# EasyEDA schematic cheap-boy_(V1.0)_2026-07-27.json
TITLE: Sheet_1; REV: 1.0; Date: 2026-07-13; Sheet: 1/1; Drawn By: rumidom
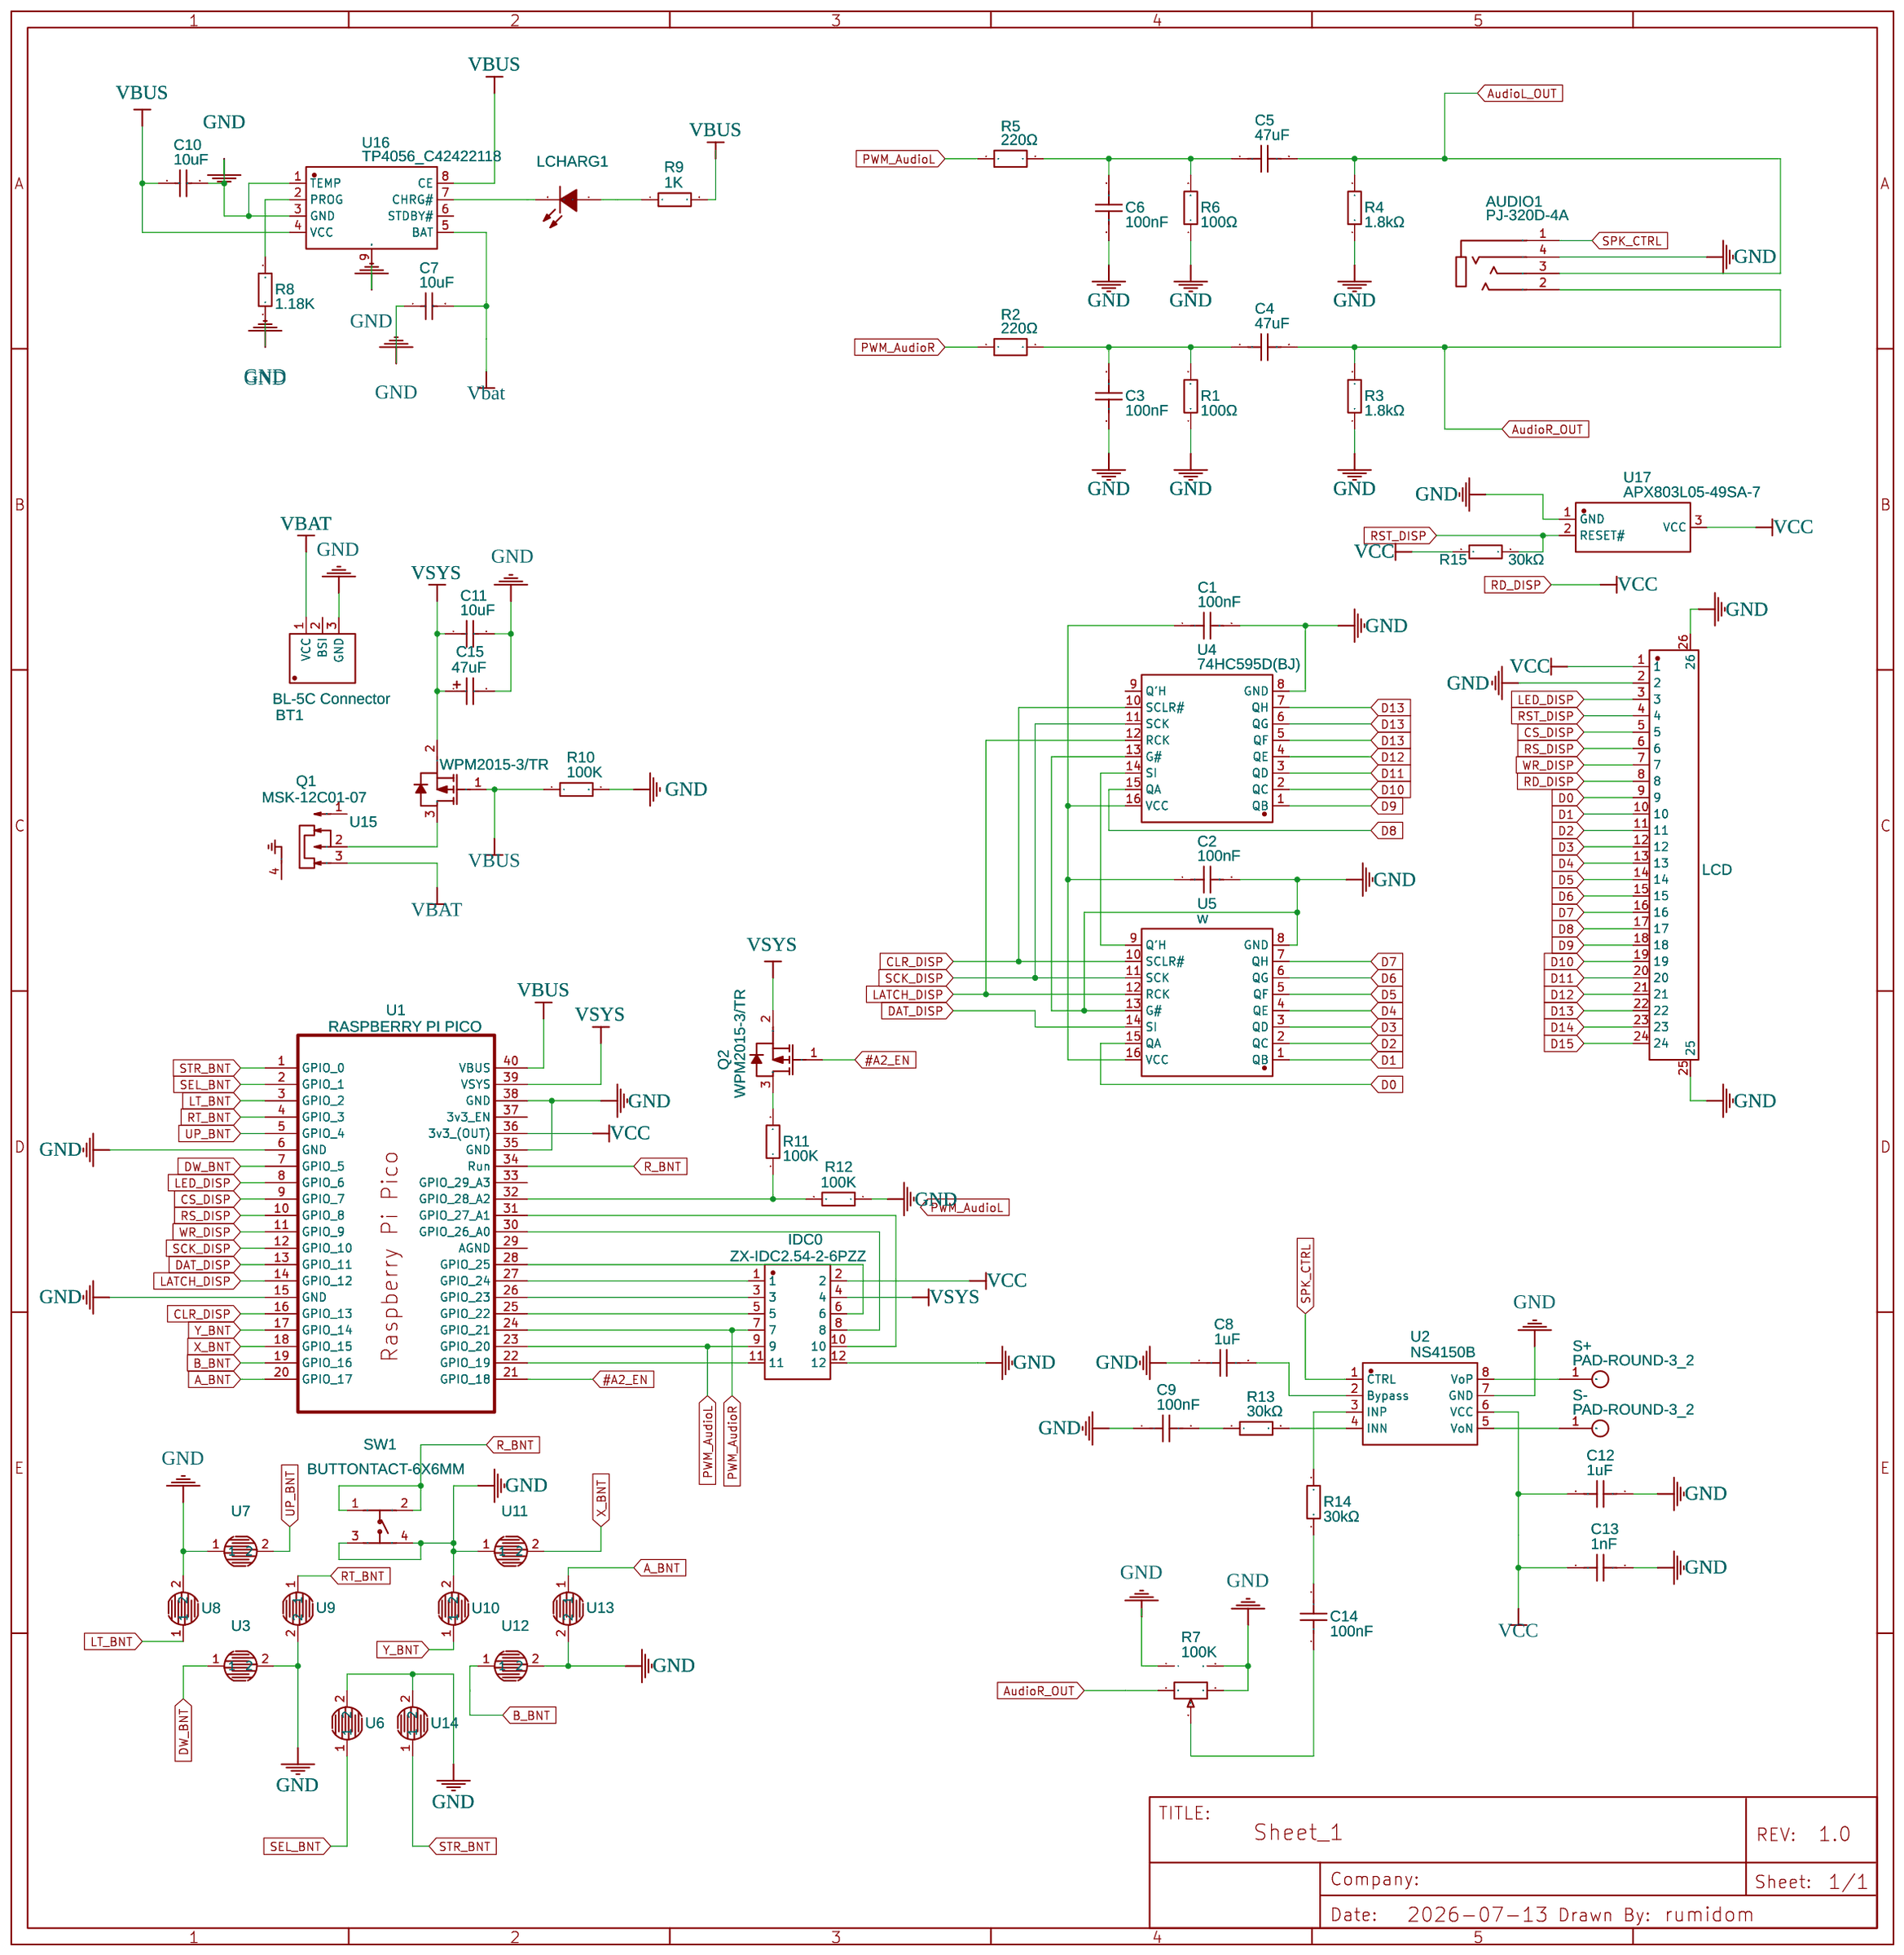
[diagram p0: schematic sheet]

## Parts
AUDIO1  PJ-320D-4A  [AUDIO-SMD_PJ-320D]
BT1  BL-5C Connector  [BL-5C CONNECTOR]
C1  100nF  [C0603]
C2  100nF  [C0603]
C3  100nF  [C0603]
C4  47uF  [C0805]
C5  47uF  [C0805]
C6  100nF  [C0603]
C7  10uF  [C0402]
C8  1uF  [C0603]
C9  100nF  [C0603]
C10  10uF  [C0402]
C11  10uF  [C0402]
C12  1uF  [C0603]
C13  1nF  [C0603]
C14  100nF  [C0603]
C15  47uF  [CAP-SMD_L3.2-W1.6-R-RD]
FPC  LCD  [FPC-SMD_24P-P0.50_FPC-05FB-24PH20]
IDC0  ZX-IDC2.54-2-6PZZ  [IDC-TH_12P-P2.54_ZX-IDC2.54-2-6PZZ]
LCHARG1  TJ-S1608SW6TGLC2R-A5  [LED0603-R-RD]
Q1  WPM2015-3/TR  [SOT-23-3_L2.9-W1.6-P1.90-LS2.8-BR]
Q2  WPM2015-3/TR  [SOT-23-3_L2.9-W1.6-P1.90-LS2.8-BR]
R1  100Ω  [R0603]
R2  220Ω  [R0603]
R3  1.8kΩ  [R0603]
R4  1.8kΩ  [R0603]
R5  220Ω  [R0603]
R6  100Ω  [R0603]
R7  100K  [RES-TH_WH160-1-104]
R8  1.18K  [R0402]
R9  1K  [R0402]
R10  100K  [R0402]
R11  100K  [R0402]
R12  100K  [R0402]
R13  30kΩ  [R0805]
R14  30kΩ  [R0805]
R15  30kΩ  [R0805]
S+  PAD-ROUND-3_2  [PADPAD]
S-  PAD-ROUND-3_2  [PADPAD]
SW1  BUTTONTACT-6X6MM  [SW-SMD_4P-L6.0-W6.0-P4.50-LS9.2]
U1  RASPBERRY PI PICO  [RASPBERRY PI PICO SMD]
U2  NS4150B  [SOIC-8_L4.9-W3.9-P1.27-LS6.0-BL]
U3  XBOX GAMEPAD DPAD BUTTON  [5MM MEMBRANE BUTTON PAD OK]
U4  74HC595D(BJ)  [SOIC-16_L9.9-W3.9-P1.27-LS6.0-BL]
U5  w  [SOIC-16_L9.9-W3.9-P1.27-LS6.0-BL]
U6  XBOX GAMEPAD DPAD BUTTON  [5MM MEMBRANE BUTTON PAD OK]
U7  XBOX GAMEPAD DPAD BUTTON  [5MM MEMBRANE BUTTON PAD OK]
U8  XBOX GAMEPAD DPAD BUTTON  [5MM MEMBRANE BUTTON PAD OK]
U9  XBOX GAMEPAD DPAD BUTTON  [5MM MEMBRANE BUTTON PAD OK]
U10  XBOX GAMEPAD DPAD BUTTON  [5MM MEMBRANE BUTTON PAD OK]
U11  XBOX GAMEPAD DPAD BUTTON  [5MM MEMBRANE BUTTON PAD OK]
U12  XBOX GAMEPAD DPAD BUTTON  [5MM MEMBRANE BUTTON PAD OK]
U13  XBOX GAMEPAD DPAD BUTTON  [5MM MEMBRANE BUTTON PAD OK]
U14  XBOX GAMEPAD DPAD BUTTON  [5MM MEMBRANE BUTTON PAD OK]
U15  MSK-12C01-07  [SW-SMD_MSK12CO2-BDM]
U16  TP4056_C42422118  [ESOP-8_L4.9-W3.9-P1.27-LS6.0-BL-EP-1]
U17  APX803L05-49SA-7  [SOT-23-3_L2.9-W1.3-P1.83-LS2.4-BL]

## Library data of the parts
AUDIO1 = PJ-320D-4A: Contributor: LCSC; Supplier: LCSC; Manufacturer: HRO; Supplier Part: C128988
BT1 = BL-5C Connector: Manufacturer: MAHA; Contributor: alif2030
C1 C2 = VJ0603Y104KXAAT: Supplier: LCSC; Supplier Part: C5342943; Manufacturer: VISHAY(威世); JLCPCB Part Class: Extended Part; Contributor: lcsc
C3 C6 C9 C14 = 0603X7R104K100NT: Supplier: LCSC; Supplier Part: C49326605; Manufacturer: AIDE(爱迪电容); JLCPCB Part Class: Extended Part; Contributor: lcsc
C4 C5 = GRM21BR60J476ME01K: Supplier: LCSC; Supplier Part: C7198905; Manufacturer: muRata(村田); Contributor: lcsc; JLCPCB Part Class: Extended Part
C7 C10 C11 = CL05A106MQ5NUNC: Supplier: LCSC; Manufacturer: SAMSUNG; LCSC Assembly: Yes; Supplier Part: C15525; SMT Type: Basic
C8 C12 = MCASE168SB7105KTNA01: Supplier: LCSC; Supplier Part: C7225350; Manufacturer: TAIYO YUDEN(太诱); JLCPCB Part Class: Extended Part; Contributor: lcsc
C13 = C0603C102J3GACAUTO7411: Contributor: LCSC; Supplier: LCSC; Supplier Part: C599630; Manufacturer: KEMET(基美); JLCPCB Part Class: Extended Part
C15 = CA45B-A-6.3V-47UF-K: Supplier: LCSC; Manufacturer: CEC; Manufacturer Part: CA45B-A-6.3V-47uF-K; Contributor: LCSC; Supplier Part: C141304; LCSC Assembly: Yes; SMT Type: Extend
FPC = FPC-05FB-24PH20 LKK: Contributor: LCSC; Supplier: LCSC; Supplier Part: C2856831; Manufacturer: XUNPU(讯普); Manufacturer Part: FPC-05FB-24PH20; JLCPCB Part Class: Extended Part
IDC0 = ZX-IDC2.54-2-6PZZ: Supplier: LCSC; Supplier Part: C7501192; Manufacturer: Megastar(兆星); Contributor: lcsc; JLCPCB Part Class: Extended Part
LCHARG1 = TJ-S1608SW6TGLC2R-A5: Supplier: LCSC; Supplier Part: C192315; Manufacturer: TOGIALED; Contributor: LCSC
Q1 Q2 = WPM2015-3/TR: Supplier: LCSC; Supplier Part: C213159; Manufacturer: Will Semicon; Contributor: LCSC; LCSC Assembly: Yes; SMT Type: Extend
R1 R6 = 0603WAF1000T5E: Supplier: LCSC; Manufacturer: UNI-ROYAL(厚声); Supplier Part: C22775; JLCPCB Part Class: Basic Part
R2 R5 = RT0603BRD07220RL: Supplier: LCSC; Supplier Part: C861232; Manufacturer: YAGEO(国巨); Contributor: lcsc; JLCPCB Part Class: Extended Part
R3 R4 = 0603WAF1801T5E: Supplier: LCSC; Manufacturer: UNI-ROYAL(厚声); Supplier Part: C4177; JLCPCB Part Class: Basic Part
R7 = Potentiometer WH160-1-104: Supplier: LCSC; Manufacturer: JML; Supplier Part: C61836; JLCPCB Part Class: Extended Part
R8 = 0402WGF1181TCE: Supplier: LCSC; Supplier Part: C270651; Manufacturer: Uniroyal Elec; Contributor: LCSC; LCSC Assembly: Yes; SMT Type: Extend
R9 = TC0225F1001TCE: Supplier: LCSC; Manufacturer: UniOhm; Supplier Part: C98841; LCSC Assembly: Yes; SMT Type: Extend
R10-R12 = RK73H1ETTP1003F: Supplier: LCSC; Manufacturer: KOA; Supplier Part: C131362
R13-R15 = 0805W8F3002T5E: Supplier: LCSC; Manufacturer: UNI-ROYAL(厚声); Supplier Part: C17621; JLCPCB Part Class: Basic Part
S+ S- = PAD-ROUND-3_2: Contributor: enzo.furloni
SW1 = BUTTONTACT-6X6MM: Contributor: LCSC; Supplier: LCSC; Supplier Part: C9900004221; Manufacturer Part: Buttontact-6x6mm; Manufacturer: null; JLCPCB Part Class: Extended Part
U1 = RASPBERRY PI PICO: Contributor: sunilgoud410
U2 = NS4150B: Contributor: lcsc; Supplier: LCSC; Supplier Part: C9900015706; Manufacturer: null; JLCPCB Part Class: Extended Part
U3 U6-U14 = XBOX GAMEPAD DPAD BUTTON: Supplier: NONE; Contributor: steve.tidball
U4 U5 = 74HC595D(BJ): Contributor: lcsc; Supplier: LCSC; Supplier Part: C7421255; Manufacturer: TOSHIBA(东芝); JLCPCB Part Class: Extended Part
U15 = MSK-12C01-07: Contributor: lcsc; Supplier: LCSC; Supplier Part: C9900005167; Manufacturer: null; JLCPCB Part Class: Extended Part
U16 = TP4056_C42422118: Supplier: LCSC; Supplier Part: C42422118; Manufacturer: TDSEMIC(拓电半导体); Manufacturer Part: TP4056; Contributor: lcsc; JLCPCB Part Class: Extended Part
U17 = APX803L05-49SA-7: Contributor: LCSC; Supplier: LCSC; Supplier Part: C2068074; Manufacturer: DIODES(美台); JLCPCB Part Class: Extended Part

## Nets
GND: AUDIO1.4 BT1.3(GND) C1.2 C2.2 C3.2 C6.2 C7.1 C8.1 C9.1 C10.2 C11.2 C12.1 C13.2 C15.2 FPC.2 FPC.25 FPC.26 IDC0.12 R1.1 R3.1 R4.1 R6.1 R7.1 R7.4 R7.5 R8.1 R10.2 R12.1 SW1.3(C) SW1.4(D) U1.6(GND) U1.15(GND) U1.35(GND) U1.38(GND) U2.7(GND) U3.2 U4.8(GND) U4.13(G#) U5.8(GND) U5.13(G#) U6.2 U7.1 U8.2 U9.2 U10.2 U11.1 U12.2 U13.2 U14.2 U16.1(TEMP) U16.3(GND) U16.9(GND) U17.1(GND)
VBAT: BT1.1(VCC) U15.3
Vbat: C7.2 U16.5(BAT)
VBUS: C10.1 Q1.1(G) R9.2 R10.1 U1.40(VBUS) U16.4(VCC) U16.8(CE)
#A2_EN: Q2.1(G) U1.21(GPIO 18)
A_BNT: U1.20(GPIO 17) U13.1
AudioL_OUT: AUDIO1.3 C5.2 R4.2
AudioR_OUT: AUDIO1.2 C4.2 R3.2 R7.3
B_BNT: U1.19(GPIO 16) U12.1
CLR_DISP: U1.16(GPIO 13) U4.10(SCLR#) U5.10(SCLR#)
CS_DISP: FPC.5 U1.9(GPIO 7)
D0: FPC.9 U5.15(QA)
D1: FPC.10 U5.1(QB)
D2: FPC.11 U5.2(QC)
D3: FPC.12 U5.3(QD)
D4: FPC.13 U5.4(QE)
D5: FPC.14 U5.5(QF)
D6: FPC.15 U5.6(QG)
D7: FPC.16 U5.7(QH)
D8: FPC.17 U4.15(QA)
D9: FPC.18 U4.1(QB)
D10: FPC.19 U4.2(QC)
D11: FPC.20 U4.3(QD)
D12: FPC.21 U4.4(QE)
D13: FPC.22 U4.5(QF) U4.6(QG) U4.7(QH)
D14: FPC.23
D15: FPC.24
DAT_DISP: U1.13(GPIO 11) U5.14(SI)
DW_BNT: U1.7(GPIO 5) U3.1
LATCH_DISP: U1.14(GPIO 12) U4.12(RCK) U5.12(RCK)
LED_DISP: FPC.3 U1.8(GPIO 6)
LT_BNT: U1.3(GPIO 2) U8.1
PWM_AudioL: IDC0.9 R5.1 U1.23(GPIO 20)
PWM_AudioR: IDC0.7 R2.1 U1.24(GPIO 21)
R_BNT: SW1.1(A) SW1.2(B) U1.34(Run)
RD_DISP: C12.2 C13.1 FPC.1 FPC.8 IDC0.2 R15.1 U1.36(3v3 (OUT)) U2.6(VCC) U17.3(VCC)
RS_DISP: FPC.6 U1.10(GPIO 8)
RST_DISP: FPC.4 R15.2 U17.2(RESET#)
RT_BNT: U1.4(GPIO 3) U9.1
SCK_DISP: U1.12(GPIO 10) U4.11(SCK) U5.11(SCK)
SEL_BNT: U1.2(GPIO 1) U6.1
SPK_CTRL: AUDIO1.1 U2.1(CTRL)
STR_BNT: U1.1(GPIO 0) U14.1
UP_BNT: U1.5(GPIO 4) U7.2
VSYS: C11.1 C15.1 IDC0.4 Q1.2(S) Q2.2(S) U1.39(VSYS)
WR_DISP: FPC.7 U1.11(GPIO 9)
X_BNT: U1.18(GPIO 15) U11.2
Y_BNT: U1.17(GPIO 14) U10.1
Net-(C1-1): C1.1 C2.1 U4.16(VCC) U5.16(VCC)
Net-(C3-1): C3.1 C4.1 R1.2 R2.2
Net-(C5-1): C5.1 C6.1 R5.2 R6.2
Net-(C8-2): C8.2 U2.2(Bypass)
Net-(C9-2): C9.2 R13.1
Net-(C14-1): C14.1 R7.2
Net-(C14-2): C14.2 R14.1
Net-(IDC0-1): IDC0.1 U1.27(GPIO 24)
Net-(IDC0-3): IDC0.3 U1.26(GPIO 23)
Net-(IDC0-5): IDC0.5 U1.25(GPIO 22)
Net-(IDC0-6): IDC0.6 U1.28(GPIO 25)
Net-(IDC0-8): IDC0.8 U1.30(GPIO 26_A0)
Net-(IDC0-10): IDC0.10 U1.31(GPIO 27_A1)
Net-(IDC0-11): IDC0.11 U1.22(GPIO 19)
Net-(LCHARG1-1): LCHARG1.1(A) R9.1
Net-(LCHARG1-2): LCHARG1.2(K) U16.7(CHRG#)
Net-(Q1-3): Q1.3(D) U15.2
Net-(Q2-3): Q2.3(D) R11.2
Net-(R8-2): R8.2 U16.2(PROG)
Net-(R11-1): R11.1 R12.2 U1.32(GPIO 28_A2)
Net-(R13-2): R13.2 U2.4(INN)
Net-(R14-2): R14.2 U2.3(INP)
Net-(S+-1): S+.1(Pad) U2.8(VoP)
Net-(S--1): S-.1(Pad) U2.5(VoN)
Net-(U4-14): U4.14(SI) U5.9(Q'H)

Not connected (* = marked no-connect by the designer): BT1 2(BSI); U1 29(AGND) 33(GPIO 29_A3) 37(3v3_EN); U4 9(Q'H); U15 1 4; U16 6(STDBY#)

## Notes on the sheet
- GND
